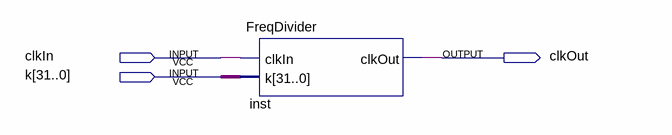
[diagram p0: schematic sheet]
// Quartus schematic FreqDividerTest.bdf as structural Verilog: 1 symbols, 3 pins
module FreqDividerTest (
  input  clkIn,
  input  [31:0] k,
  output clkOut
);

  FreqDivider inst (.clkIn(clkIn), .k(k), .clkOut(clkOut));
endmodule
